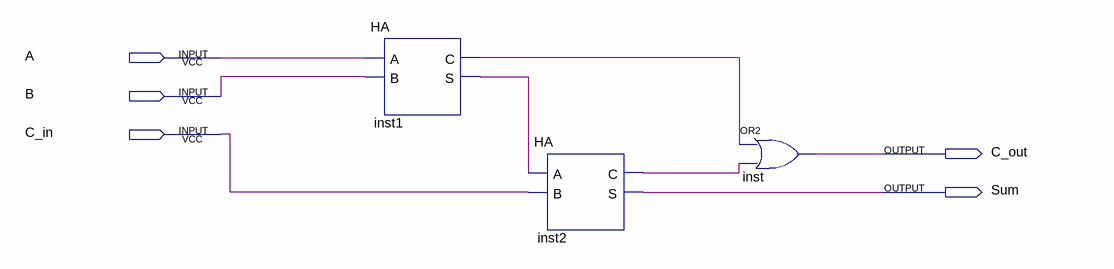
[diagram p0: schematic sheet]
// Quartus schematic FA.bdf as structural Verilog: 3 symbols, 5 pins
module FA (
  input  A,
  input  B,
  input  C_in,
  output C_out,
  output Sum
);

  wire inst1_c, inst1_s, inst2_c;

  HA inst1 (.A(A), .B(B), .C(inst1_c), .S(inst1_s));
  HA inst2 (.A(inst1_s), .B(C_in), .C(inst2_c), .S(Sum));
  or inst (C_out, inst1_c, inst2_c);
endmodule
